# EAGLE design electricals_with_iPod_v2 (EAGLE 6.5.0)
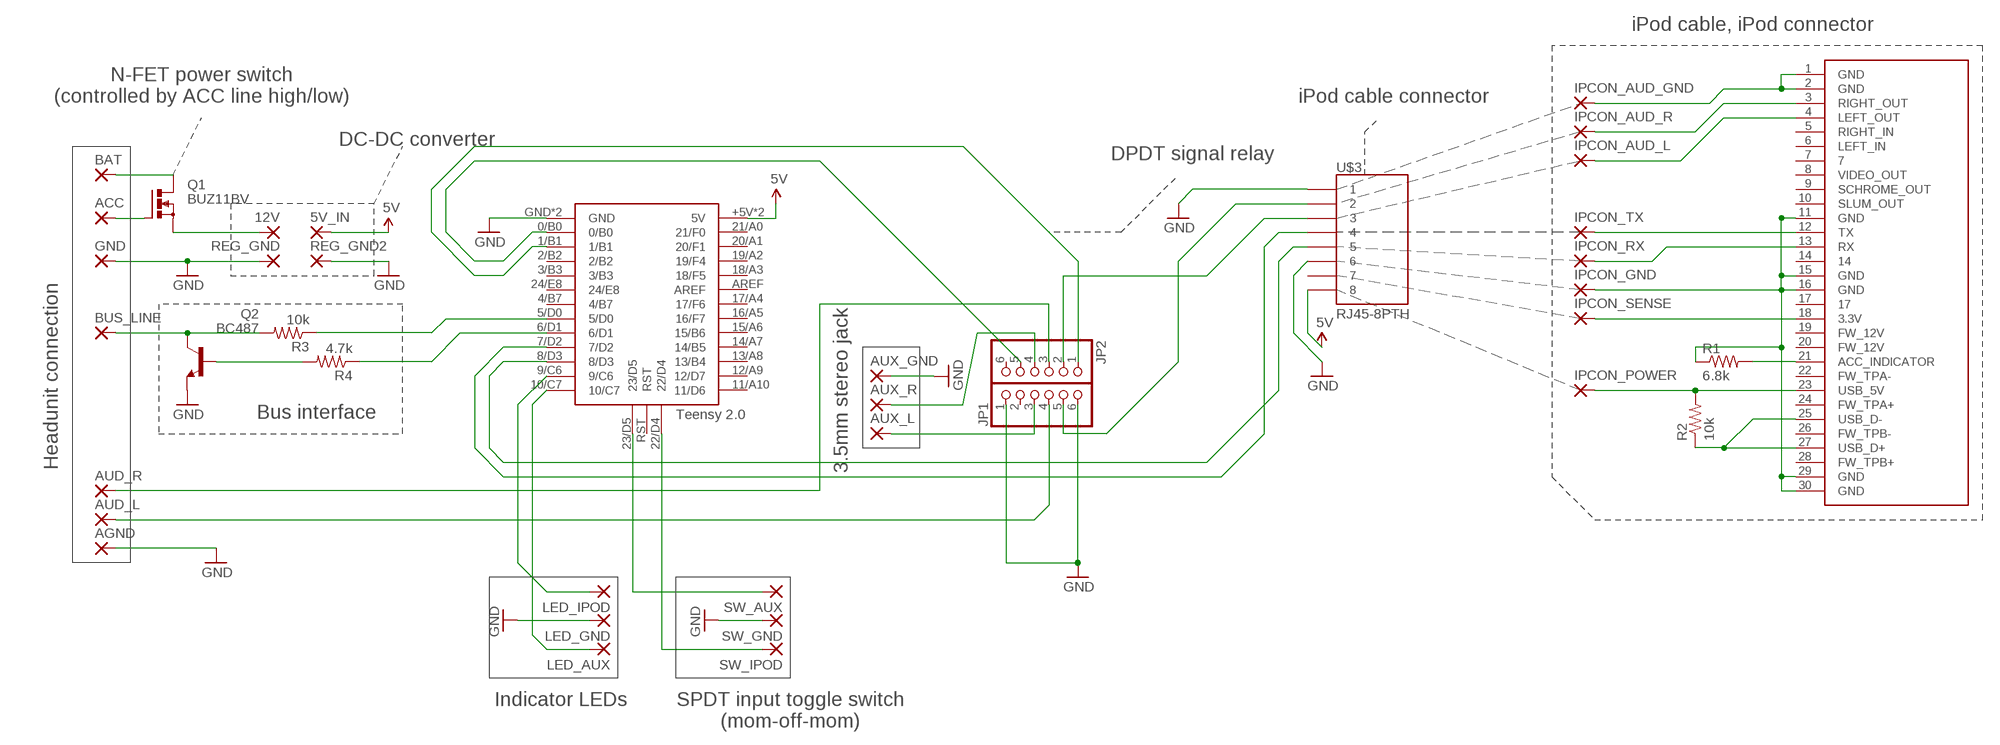
[diagram p0: schematic, sheet 1]

## Parts
5V_IN  2,54/1,1  [2,54/1,1]
12V  2,54/1,1  [2,54/1,1]
ACC  1,6/0,9  [1,6/0,9]
AGND  1,6/0,9  [1,6/0,9]
AUD_L  1,6/0,9  [1,6/0,9]
AUD_R  1,6/0,9  [1,6/0,9]
AUX_GND  1,6/0,9  [1,6/0,9]
AUX_L  1,6/0,9  [1,6/0,9]
AUX_R  1,6/0,9  [1,6/0,9]
BAT  2,54/1,1  [2,54/1,1]
BUS_LINE  1,6/0,9  [1,6/0,9]
GND  2,54/1,1  [2,54/1,1]
IPCON_AUD_GND  1,6/0,9  [1,6/0,9]
IPCON_AUD_L  1,6/0,9  [1,6/0,9]
IPCON_AUD_R  1,6/0,9  [1,6/0,9]
IPCON_GND  1,6/0,9  [1,6/0,9]
IPCON_POWER  1,6/0,9  [1,6/0,9]
IPCON_RX  1,6/0,9  [1,6/0,9]
IPCON_SENSE  1,6/0,9  [1,6/0,9]
IPCON_TX  1,6/0,9  [1,6/0,9]
JP1  PINHD-1X6  [1X06]
JP2  PINHD-1X6  [1X06]
LED_AUX  1,6/0,9  [1,6/0,9]
LED_GND  1,6/0,9  [1,6/0,9]
LED_IPOD  1,6/0,9  [1,6/0,9]
Q1  BUZ11BV  [TO220BV]
Q2  BC487  [TO92-EBC]
R1  6.8k  RESISTOR1206  [1206]
R2  10k  RESISTOR1206  [1206]
R3  10k  RESISTOR1206  [1206]
R4  4.7k  RESISTOR1206  [1206]
REG_GND  2,54/1,1  [2,54/1,1]
REG_GND2  2,54/1,1  [2,54/1,1]
SW_AUX  1,6/0,9  [1,6/0,9]
SW_GND  1,6/0,9  [1,6/0,9]
SW_IPOD  1,6/0,9  [1,6/0,9]
U$1  IPOD_CONNECTOR_MALE  [IPOD_MALE_CONNECTOR]
U$3  RJ45-8PTH  [RJ45-8]
U$5  TEENSY-2.0  [TEENSY_2.0]

## Nets
5V: 5V_IN.1(P) U$3.8 U$5.+5V(5V) U$5.+5V_(5V)
GND: AGND.1(P) AUX_GND.1(P) GND.1(P) JP1.1 JP1.6 LED_GND.1(P) Q2.E REG_GND2.1(P) REG_GND.1(P) SW_GND.1(P) U$3.1 U$3.6 U$5.GND U$5.GND_(GND)
N$1: ACC.1(P) Q1.G
N$2: BAT.1(P) Q1.D
N$3: 12V.1(P) Q1.S
N$4: IPCON_POWER.1(P) R2.2 U$1.23(USB_5V)
N$5: IPCON_AUD_GND.1(P) U$1.1(GND) U$1.2(GND)
N$6: IPCON_SENSE.1(P) U$1.18(3.3V)
N$7: IPCON_RX.1(P) U$1.13(RX)
N$8: IPCON_TX.1(P) U$1.12(TX)
N$9: IPCON_AUD_R.1(P) U$1.3(RIGHT_OUT)
N$10: IPCON_AUD_L.1(P) U$1.4(LEFT_OUT)
N$11: R2.1 U$1.25(USB_D-) U$1.27(USB_D+)
N$12: IPCON_GND.1(P) R1.1 U$1.11(GND) U$1.15(GND) U$1.16(GND) U$1.29(GND) U$1.30(GND)
N$13: R1.2 U$1.21(ACC_INDICATOR)
N$14: U$3.4 U$5.7/D2
N$15: AUD_L.1(P) JP1.4
N$16: AUD_R.1(P) JP2.3
N$17: AUX_L.1(P) JP1.3
N$18: AUX_R.1(P) JP2.4
N$19: BUS_LINE.1(P) Q2.C R3.2
N$20: Q2.B R4.2
N$21: R3.1 U$5.5/D0
N$22: R4.1 U$5.6/D1
N$23: JP1.5 U$3.2
N$24: JP2.2 U$3.3
N$25: U$3.5 U$5.8/D3
N$26: LED_IPOD.1(P) U$5.9/C6
N$27: LED_AUX.1(P) U$5.10/C7
N$28: SW_AUX.1(P) U$5.23/D5
N$29: SW_IPOD.1(P) U$5.22/D4
N$30: JP2.5 U$5.0/B0
N$31: JP2.1 U$5.1/B1
Unconnected: JP1.2 JP2.6 U$1.5(RIGHT_IN) U$1.6(LEFT_IN) U$1.7 U$1.8(VIDEO_OUT) U$1.9(SCHROME_OUT) U$1.10(SLUM_OUT) U$1.14 U$1.17 U$1.19(FW_12V) U$1.20(FW_12V) U$1.22(FW_TPA-) U$1.24(FW_TPA+) U$1.26(FW_TPB-) U$1.28(FW_TPB+) U$3.7 U$5.2/B2 U$5.3/B3 U$5.4/B7 U$5.11/A10(11/D6) U$5.12/A9(12/D7) U$5.13/A8(13/B4) U$5.14/A7(14/B5) U$5.15/A6(15/B6) U$5.16/A5(16/F7) U$5.17/A4(17/F6) U$5.18/A3(18/F5) U$5.19/A2(19/F4) U$5.20/A1(20/F1) U$5.21/A0(21/F0) U$5.24/E8 U$5.AREF U$5.RST

## Notes on the sheet
- iPod cable, iPod connector
- N-FET power switch
  (controlled by ACC line high/low)
- iPod cable connector
- DC-DC converter
- DPDT signal relay
- Headunit connection
- 3.5mm stereo jack
- Bus interface
- Indicator LEDs
- SPDT input toggle switch
  (mom-off-mom)

## Library data of the parts
5V_IN 12V BAT GND REG_GND REG_GND2 = wirepad:2,54/1,1: THROUGH-HOLE PAD
ACC AGND AUD_L AUD_R AUX_GND AUX_L AUX_R BUS_LINE IPCON_AUD_GND IPCON_AUD_L IPCON_AUD_R IPCON_GND IPCON_POWER IPCON_RX IPCON_SENSE IPCON_TX LED_AUX LED_GND LED_IPOD SW_AUX SW_GND SW_IPOD = wirepad:1,6/0,9: THROUGH-HOLE PAD
JP1 JP2 = pinhead:PINHD-1X6: PIN HEADER
Q1 = transistor-power:BUZ11: N-CHANNEL MOS FET
Q2 = transistor-npn:BC487*: NPN Transistor
R1-R4 = SparkFun-Resistors:RESISTOR: Resistor Basic schematic elements and footprints for 0603, 1206, and PTH resistors.
U$1 = SparkFun:IPOD_CONNECTOR_MALE: iPod Male Connector This is the connector that will insert into an iPods. Use this connector to gain access to the various iPod pins. Schematic and footprint are not yet production proven. The PCB thickness must be more thin than the standard 0.062" FR4. Spark Fun Electronics SKU : DEV-00633
U$3 = SparkFun-Connectors:RJ45-8: RJ45 Jack Simple RJ45, 8-pin connection - connector for common Cat5, Cat5e, and Cat6 Ethernet cables. Footprint not yet proven in production. Connector sku is PRT-00643; Breakout PCB sku is BOB-00716.
U$5 = personal:TEENSY-2.0

## Board
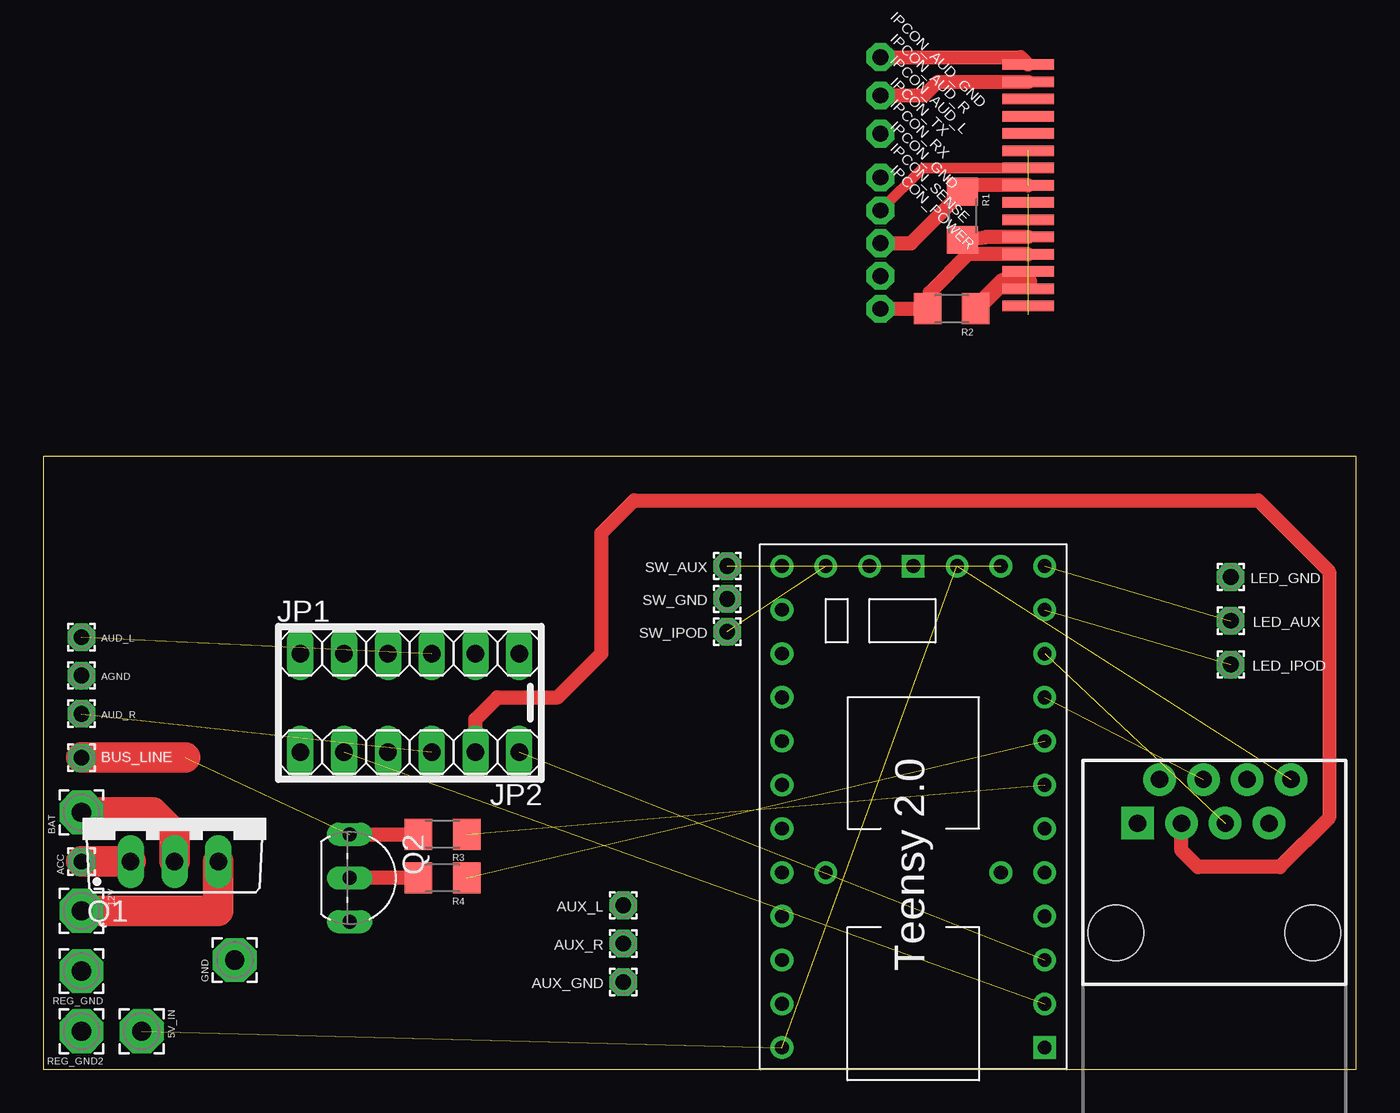
[diagram p1: board, top side]
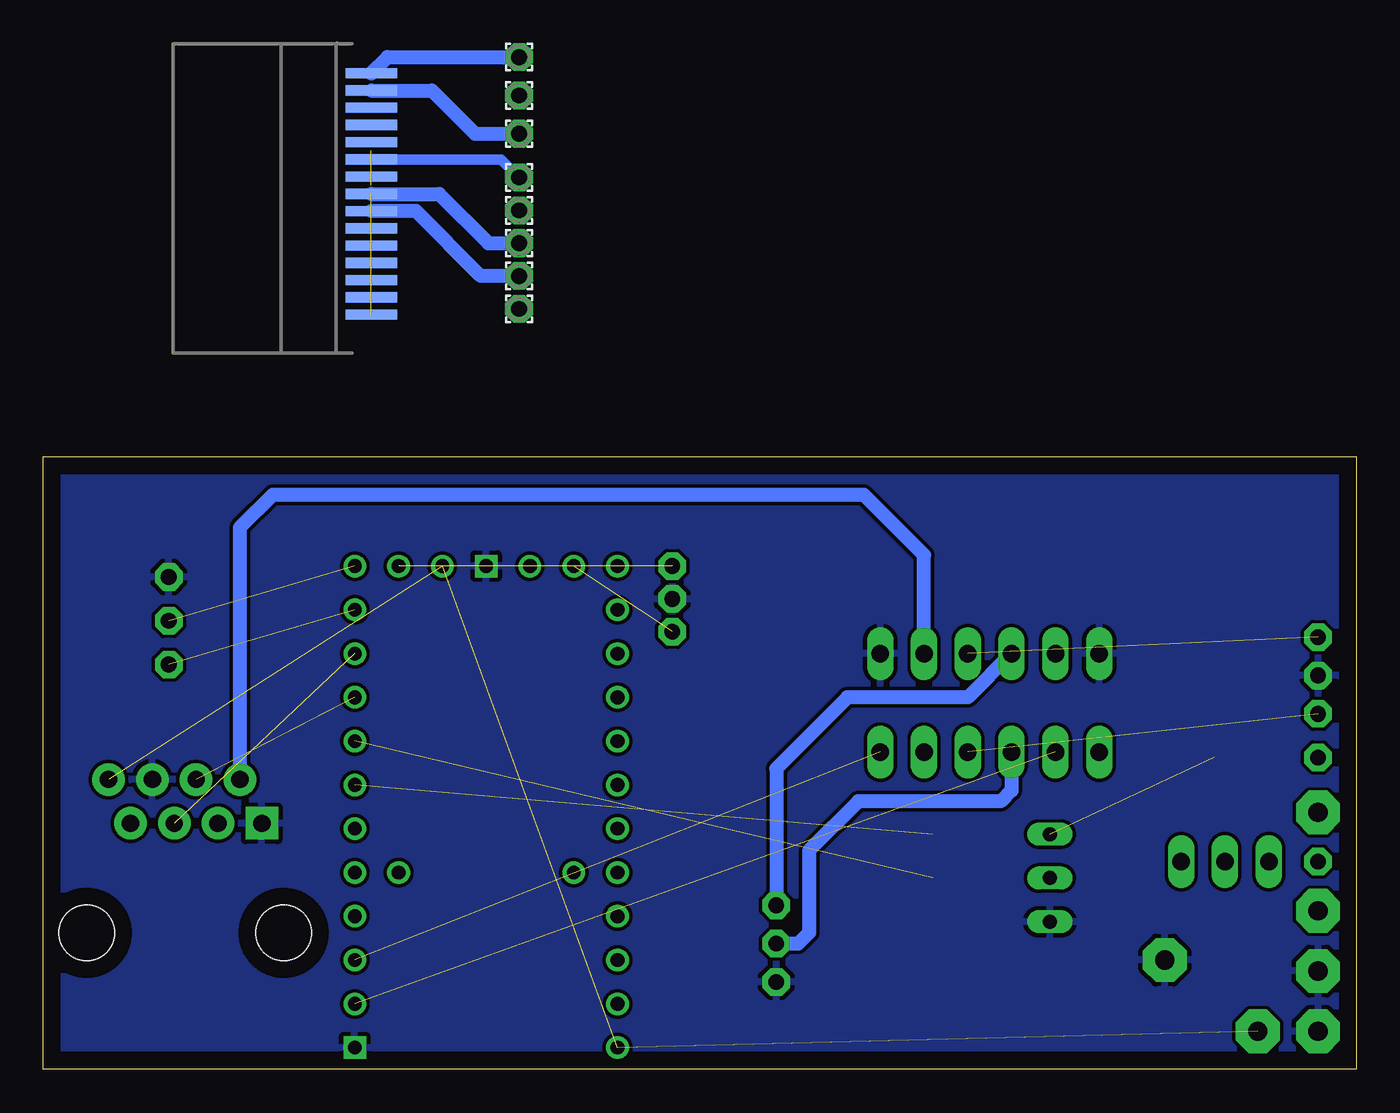
[diagram p2: board, bottom side, seen from below]

Size 76.19 x 35.55 mm. Coordinates in mm from the lower left corner, seen from the top.
Outline: 0,0 76.19,0 76.19,35.55 0,35.55 0,0
Copper layers (1*16): Top 0.035mm / dielectric 1.5mm / Bottom 0.035mm
Design rules "default": minimum track width 10mil, minimum drill 24mil, track to track 8mil, track to pad 8mil, pad to pad 8mil, via to via 8mil, smd to smd 8mil, copper to edge 40mil, drill to drill 8mil, minimum pad ring 10mil, minimum via ring 8mil, stop-mask expansion 4mil, vias tented up to drill 0mil, thermal gap 10mil

### Footprints (pad centres in the part's own frame; a part is rotated, then mirrored left to right if it is on the bottom)
2,54/1,1 = drill 1.118 pad 2.54 octagon: 1 0,0
1,6/0,9 = drill 0.914 pad 1.6 octagon: 1 0,0
1X06 = drill 1.016 long: 1 -6.35,0; 2 -3.81,0; 3 -1.27,0; 4 1.27,0; 5 3.81,0; 6 6.35,0
TO220BV = drill 1.016 long: D 0,-2.54; G -2.54,-2.54; S 2.54,-2.54
TO92-EBC = drill 0.813 long: B 0,-1.27; C -2.54,-1.27; E 2.54,-1.27
1206 = smd 1.6 x 1.8: 1 -1.4,0; 2 1.4,0
IPOD_MALE_CONNECTOR = smd 0.6 x 3 bottom: 1 7.5,0; 3 6.5,0; 5 5.5,0; 7 4.5,0; 9 3.5,0; 11 2.5,0; 13 1.5,0; 15 0.5,0; 17 -0.5,0; 19 -1.5,0; 21 -2.5,0; 23 -3.5,0; 25 -4.5,0; 27 -5.5,0; 29 -6.5,0 | smd 0.6 x 3: 2 7,0; 4 6,0; 6 5,0; 8 4,0; 10 3,0; 12 2,0; 14 1,0; 16 0,0; 18 -1,0; 20 -2,0; 22 -3,0; 24 -4,0; 26 -5,0; 28 -6,0; 30 -7,0
RJ45-8 = drill 1 pad 1.88 square: 1 -4.445,6.35 | drill 1 pad 1.88: 2 -3.175,8.89; 3 -1.905,6.35; 4 -0.635,8.89; 5 0.635,6.35; 6 1.905,8.89; 7 3.175,6.35; 8 4.445,8.89 | hole 3.2: -5.715,0; 5.715,0
TEENSY_2.0 = drill 0.8: 0/B0 -7.62,15.24; 1/B1 -7.62,12.7; 2/B2 -7.62,10.16; 3/B3 -7.62,7.62; 4/B7 -7.62,5.08; 5/D0 -7.62,2.54; 6/D1 -7.62,0; 7/D2 -7.62,-2.54; 8/D3 -7.62,-5.08; 9/C6 -7.62,-7.62; 10/C7 -7.62,-10.16; 11/A10 7.62,-10.16; 12/A9 7.62,-7.62; 13/A8 7.62,-5.08; 14/A7 7.62,-2.54; 15/A6 7.62,0; 16/A5 7.62,2.54; 17/A4 7.62,5.08; 18/A3 7.62,7.62; 19/A2 7.62,10.16; 20/A1 7.62,12.7; 21/A0 7.62,15.24; 22/D4 5.08,-10.16; 23/D5 -5.08,-10.16; 24/E8 -5.08,7.62; +5V 7.62,17.78; +5V_ -2.54,-10.16; AREF 5.08,7.62; RST 2.54,-10.16 | drill 0.8 square: GND -7.62,17.78; GND_ 0,-10.16

### Placement (x,y rotation side)
5V_IN  5.71,2.22 270 top
12V  2.22,9.21 270 top
ACC  2.22,12.06 90 top
AGND  2.22,22.86 90 top
AUD_L  2.22,25.08 90 top
AUD_R  2.22,20.64 90 top
AUX_GND  33.66,5.08 180 top
AUX_L  33.66,9.53 180 top
AUX_R  33.66,7.3 180 top
BAT  2.22,14.92 90 top
BUS_LINE  2.22,18.1 0 top
GND  11.11,6.35 90 top
IPCON_AUD_GND  48.58,58.74 0 bottom  (outside the outline)
IPCON_AUD_L  48.58,54.29 0 bottom  (outside the outline)
IPCON_AUD_R  48.58,56.52 0 bottom  (outside the outline)
IPCON_GND  48.58,47.94 0 bottom  (outside the outline)
IPCON_POWER  48.58,44.13 0 bottom  (outside the outline)
IPCON_RX  48.58,49.85 0 bottom  (outside the outline)
IPCON_SENSE  48.58,46.04 0 bottom  (outside the outline)
IPCON_TX  48.58,51.75 0 bottom  (outside the outline)
JP1  21.27,24.13 0 top
JP2  21.27,18.41 180 top
LED_AUX  68.9,26.04 90 top
LED_GND  68.9,28.57 90 top
LED_IPOD  68.9,23.5 180 top
Q1  7.62,14.61 0 top
Q2  19.05,11.11 270 top
R1  53.34,49.53 270 top  (outside the outline)
R2  52.7,44.13 180 top  (outside the outline)
R3  23.18,13.65 180 top
R4  23.18,11.11 180 top
REG_GND  2.22,5.71 180 top
REG_GND2  2.22,2.22 180 top
SW_AUX  39.69,29.21 180 top
SW_GND  39.69,27.3 180 top
SW_IPOD  39.69,25.4 180 top
U$1  57.15,50.8 90 bottom  (outside the outline)
U$3  67.94,7.94 0 top
U$5  50.48,19.05 180 top

### Tracks (layer width: path | path; a pad name or v marks a point on that pad's centre or on a via)
5V  (3 unrouted)
GND
  pour Bottom: 0,35.56 76.2,35.56 76.2,0 0,0
N$1
  Top 1.778: ACC.1 Q1.G
N$2
  Top 1.778: BAT.1 6.35,14.92 7.62,13.65 Q1.D
N$3
  Top 1.778: Q1.S 10.16,9.21 12V.1
N$4
  Top 0.61: 51.44,43.95 R2.2
  Top 0.813: U$1.23 53.65,47.3 51.44,45.09 51.44,43.95 | IPCON_POWER.1 R2.2
N$5
  Top 0.813: IPCON_AUD_GND.1 56.71,58.74 U$1.1
  Bottom 0.813: U$1.2 56.21,58.74 IPCON_AUD_GND.1
N$6
  Bottom 0.813: IPCON_SENSE.1 50.8,46.04 54.56,49.8 U$1.18
N$7
  Top 0.61: U$1.13 51.03,52.3 IPCON_RX.1
N$8
  Bottom 0.61: U$1.12 49.62,52.8 IPCON_TX.1
N$9
  Top 0.813: IPCON_AUD_R.1 51.12,56.52 51.9,57.3 U$1.3
N$10
  Bottom 0.813: U$1.4 53.62,56.8 51.12,54.29 IPCON_AUD_L.1
N$11
  Top 0.61: U$1.25 57.15,45.72 U$1.27
  Top 1.016: R2.1 55.69,45.72 57.15,45.72
N$12  (3 unrouted)
  Top 0.813: IPCON_GND.1 50.35,47.94 R1.1 53.71,51.3 U$1.15
  Bottom 0.813: U$1.16 53.21,50.8 50.35,47.94 IPCON_GND.1
N$13
  Top 0.813: U$1.21 54.7,48.3 R1.2
N$14  (1 unrouted)
N$15  (1 unrouted)
N$16  (1 unrouted)
N$17
  Bottom 0.813: JP1.3 22.54,21.59 29.53,21.59 33.66,17.46 AUX_L.1
N$18
  Bottom 0.813: JP2.4 20,16.19 20.64,15.56 28.89,15.56 31.75,12.7 31.75,7.94 32.38,7.3 AUX_R.1
N$19  (1 unrouted)
  Top 0.813: Q2.C R3.2
  Top 1.778: BUS_LINE.1 8.26,18.1
N$20
  Top 0.813: R4.2 Q2.B
N$21  (1 unrouted)
N$22  (1 unrouted)
N$23
  Bottom 0.813: JP1.5 25.08,29.84 28.57,33.34 62.87,33.34 64.77,31.43 U$3.2
N$24
  Top 0.813: JP2.2 25.08,20.32 26.35,21.59 29.84,21.59 32.38,24.13 32.38,31.11 34.29,33.02 70.48,33.02 74.61,28.89 74.61,14.61 71.75,11.75 66.99,11.75 66.04,12.7 U$3.3
N$25  (1 unrouted)
N$26  (1 unrouted)
N$27  (1 unrouted)
N$28  (1 unrouted)
N$29  (1 unrouted)
N$30  (1 unrouted)
N$31  (1 unrouted)